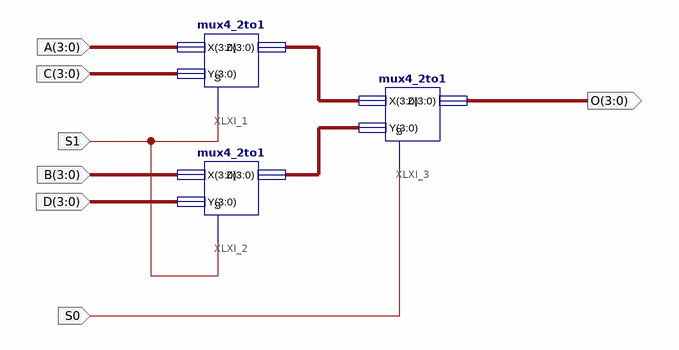
[diagram p0: schematic sheet 1]
// Xilinx ISE schematic mux4_4to1.sch (virtex6) as structural Verilog: 3 symbols, 7 ports
module mux4_4to1 (
  input  S0,
  input  S1,
  input  [3:0] B,
  input  [3:0] D,
  input  [3:0] C,
  input  [3:0] A,
  output [3:0] O
);

  wire [3:0] XLXN_1, XLXN_2;

  mux4_2to1 XLXI_1 (.S(S1), .X(A), .Y(C), .Z(XLXN_1));
  mux4_2to1 XLXI_2 (.S(S1), .X(B), .Y(D), .Z(XLXN_2));
  mux4_2to1 XLXI_3 (.S(S0), .X(XLXN_1), .Y(XLXN_2), .Z(O));
endmodule
